# EAGLE design Stoitsov_Bostandzhieva (EAGLE 7.4.0)
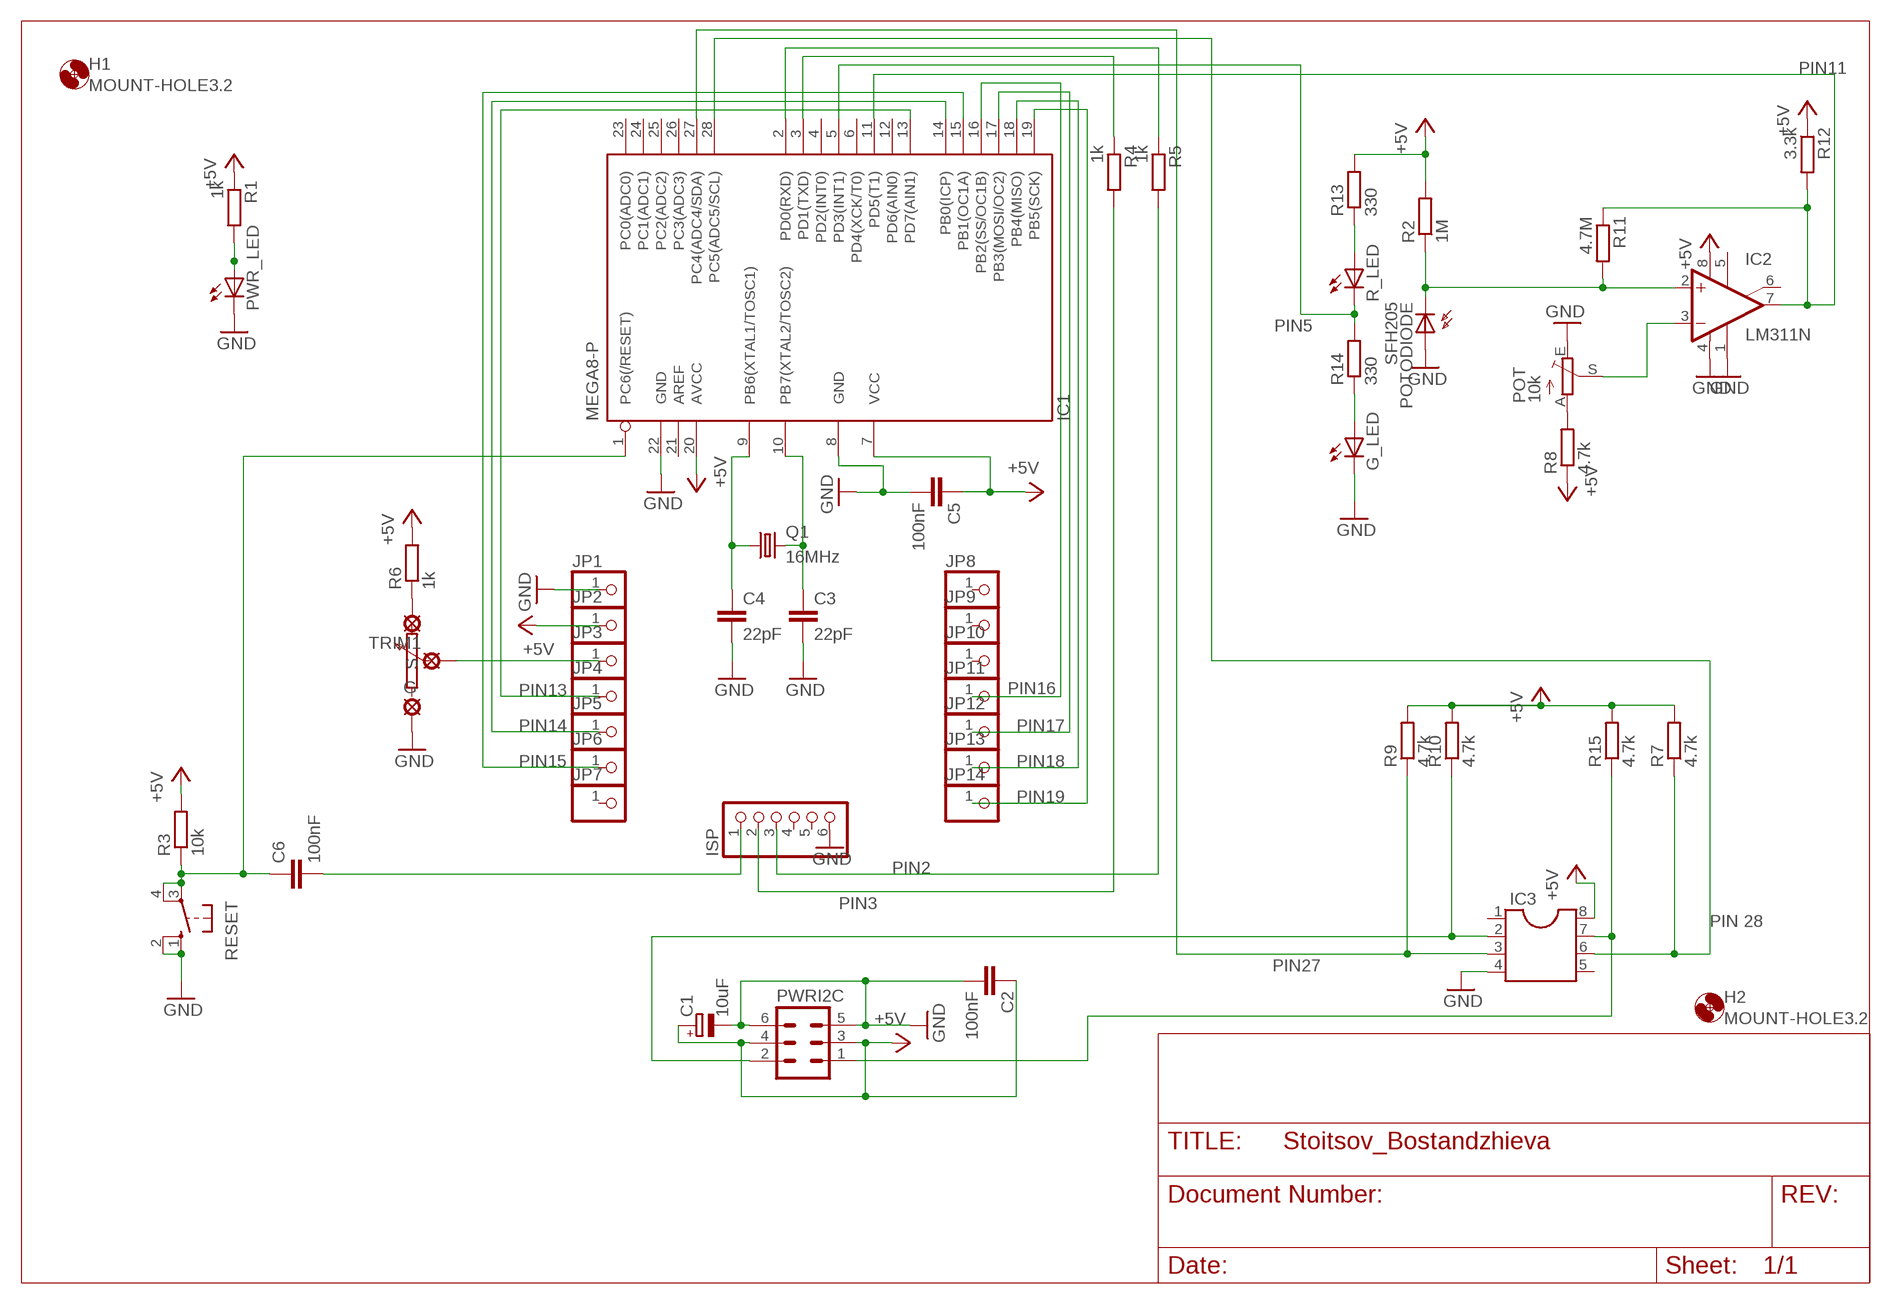
[diagram p0: schematic, sheet 1]

## Parts
C1  10uF  CPOL-EUE5-6  [E5-6]
C2  100nF  C5/2.5  [C5B2.5]
C3  22pF  C5/2.5  [C5B2.5]
C4  22pF  C5/2.5  [C5B2.5]
C5  100nF  C5/2.5  [C5B2.5]
C6  100nF  C5/2.5  [C5B2.5]
G  LSP11  [LSP11]
G_LED  LED3MM  [LED3MM]
H1  MOUNT-HOLE3.2  [3,2]
H2  MOUNT-HOLE3.2  [3,2]
IC1  MEGA8-P  [DIL28-3]
IC2  LM311N  [DIL08]
IC3  DIL8S  [SOCKET-08]
ISP  PINHD-1X6/90  [1X06/90]
JP1  PINHD-1X1  [1X01]
JP2  PINHD-1X1  [1X01]
JP3  PINHD-1X1  [1X01]
JP4  PINHD-1X1  [1X01]
JP5  PINHD-1X1  [1X01]
JP6  PINHD-1X1  [1X01]
JP7  PINHD-1X1  [1X01]
JP8  PINHD-1X1  [1X01]
JP9  PINHD-1X1  [1X01]
JP10  PINHD-1X1  [1X01]
JP11  PINHD-1X1  [1X01]
JP12  PINHD-1X1  [1X01]
JP13  PINHD-1X1  [1X01]
JP14  PINHD-1X1  [1X01]
POT  10k  TRIM_EU-S64W  [S64W]
POTODIODE  SFH205  [SFH205]
PWR_LED  LED3MM  [LED3MM]
PWRI2C  MA03-2  [MA03-2]
Q1  16MHz  CRYSTALHC18U-V  [HC18U-V]
R1  1k  R-EU_0207/12  [0207/12]
R2  1M  R-EU_0207/12  [0207/12]
R3  10k  R-EU_0207/12  [0207/12]
R4  1k  R-EU_0207/12  [0207/12]
R5  1k  R-EU_0207/12  [0207/12]
R6  1k  R-EU_0207/12  [0207/12]
R7  4.7k  R-EU_0207/12  [0207/12]
R8  4.7k  R-EU_0207/12  [0207/12]
R9  4.7k  R-EU_0207/12  [0207/12]
R10  4.7k  R-EU_0207/12  [0207/12]
R11  4.7M  R-EU_0207/12  [0207/12]
R12  3.3k  R-EU_0207/12  [0207/12]
R13  330  R-EU_0207/12  [0207/12]
R14  330  R-EU_0207/12  [0207/12]
R15  4.7k  R-EU_0207/12  [0207/12]
R_LED  LED3MM  [LED3MM]
RESET  10-XX  [B3F-10XX]
S  LSP11  [LSP11]
TRIM1  LSP11  [LSP11]

## Nets
+5V: C1.+ C2.1 C5.1 IC1.7(VCC) IC1.20(AVCC) IC2.8(V+) IC3.8 JP2.1 PWRI2C.3 PWRI2C.4 R1.1 R2.2 R3.2 R6.2 R7.2 R8.1 R9.2 R10.2 R12.1 R13.2 R15.2
GND: C1.- C2.2 C3.2 C4.2 C5.2 G.MP G_LED.K(C) IC1.8(GND) IC1.22(GND) IC2.1(GND) IC2.4(V-) IC3.4 ISP.6 JP1.1 POT.E POTODIODE.A PWR_LED.K(C) PWRI2C.5 PWRI2C.6 RESET.1(S) RESET.2(S1)
N$1: IC2.2(+IN) POTODIODE.K(C) R2.1 R11.2
N$2: IC1.11(PD5(T1)) IC2.7(OUT) R11.1 R12.2
N$3: POT.A R8.2
N$4: PWR_LED.A R1.2
N$5: C6.1 IC1.1(PC6(/RESET)) R3.1 RESET.3(P) RESET.4(P1)
N$6: C4.1 IC1.9(PB6(XTAL1/TOSC1)) Q1.1
N$7: C3.1 IC1.10(PB7(XTAL2/TOSC2)) Q1.2
N$8: C6.2 ISP.1
N$9: JP3.1 S.MP
N$10: IC1.3(PD1(TXD)) R4.1
N$11: IC1.2(PD0(RXD)) R5.1
N$12: ISP.2 R4.2
N$13: ISP.3 R5.2
N$14: R6.1 TRIM1.MP
N$15: IC1.27(PC4(ADC4/SDA)) IC3.3 R9.1
N$16: IC1.28(PC5(ADC5/SCL)) IC3.6 R7.1
N$18: IC3.7 PWRI2C.1 R15.1
N$19: IC1.19(PB5(SCK)) JP14.1
N$20: IC1.18(PB4(MISO)) JP13.1
N$21: IC1.17(PB3(MOSI/OC2)) JP12.1
N$22: IC1.16(PB2(SS/OC1B)) JP11.1
N$23: IC1.5(PD3(INT1)) R14.2 R_LED.K(C)
N$24: R13.1 R_LED.A
N$25: G_LED.A R14.1
N$26: IC2.3(-IN) POT.S
N$27: IC1.13(PD7(AIN1)) JP4.1
N$28: IC1.15(PB1(OC1A)) JP6.1
N$29: IC1.14(PB0(ICP)) JP5.1
N$30: IC3.2 PWRI2C.2 R10.1
Unconnected: IC1.4(PD2(INT0)) IC1.6(PD4(XCK/T0)) IC1.12(PD6(AIN0)) IC1.21(AREF) IC1.23(PC0(ADC0)) IC1.24(PC1(ADC1)) IC1.25(PC2(ADC2)) IC1.26(PC3(ADC3)) IC2.5(ON) IC2.6(ON/STR) IC3.1 IC3.5 ISP.4 ISP.5 JP7.1 JP8.1 JP9.1 JP10.1

## Notes on the sheet
- PIN11
- PIN5
- PIN13 | PIN16
- PIN14 | PIN17
- PIN15 | PIN18
- PIN19
- PIN2
- PIN3
- PIN 28
- PIN27

## Library data of the parts
C1 = resistor:CPOL-EU: POLARIZED CAPACITOR, European symbol
C2-C6 = capacitor-wima:C: CAPACITOR naming: grid - package width
G S TRIM1 = solpad:LSP11: SOLDER PAD drill 1.1 mm
G_LED PWR_LED R_LED = led:LED: LED OSRAM: - CHIPLED LG R971, LG N971, LY N971, LG Q971, LY Q971, LO R971, LY R971 LH N974, LH R974 LS Q976, LO Q976, LY Q976 LO Q996 - Hyper CHIPLED LW Q18S LB Q993, LB Q99A, LB R99A - SideLED LS A670, LO A670, LY A670, LG A670, LP A670 LB A673, LV A673, LT A673, LW A673 LH A674 LY A675 LS A676, LA A676, LO A676, LY A676, LW A676 LS A679, LY A679, LG A679 - Hyper Micro SIDELED® LS Y876, LA Y876, LO Y876, LY Y876 LT Y87S - SmartLED LW L88C, LW L88S LB L89C, LB L89S, LG L890 LS L89K, LO L89K, LY L89K LS L896, LA L896, LO L896, LY L896 - TOPLED LS T670, LO T670, LY T670, LG T670, LP T670 LSG T670, LSP T670, LSY T670, LOP T670, LYG T670 LG T671, LOG T671, LSG T671 LB T673, LV T673, LT T673, LW T673 LH T674 LS T676, LA T676, LO T676, LY T676, LB T676, LH T676, LSB T676, LW T676 LB T67C, LV T67C, LT T67C, LS T67K, LO T67K, LY T67K, LW E67C LS E67B, LA E67B, LO E67B, LY E67B, LB E67C, LV E67C, LT E67C LW T67C LS T679, LY T679, LG T679 LS T770, LO T770, LY T770, LG T770, LP T770 LB T773, LV T773, LT T773, LW T773 LH T774 LS E675, LA E675, LY E675, LS T675 LS T776, LA T776, LO T776, LY T776, LB T776 LHGB T686 LT T68C, LB T68C - Hyper Mini TOPLED® LB M676 - Mini TOPLED Santana® LG M470 LS M47K, LO M47K, LY M47K Source: http://www.osram.convergy.de LUXEON: - LUMILED® LXK2-PW12-R00, LXK2-PW12-S00, LXK2-PW14-U00, LXK2-PW14-V00 LXK2-PM12-R00, LXK2-PM12-S00, LXK2-PM14-U00 LXK2-PE12-Q00, LXK2-PE12-R00, LXK2-PE12-S00, LXK2-PE14-T00, LXK2-PE14-U00 LXK2-PB12-K00, LXK2-PB12-L00, LXK2-PB12-M00, LXK2-PB14-N00, LXK2-PB14-P00, LXK2-PB14-Q00 LXK2-PR12-L00, LXK2-PR12-M00, LXK2-PR14-Q00, LXK2-PR14-R00 LXK2-PD12-Q00, LXK2-PD12-R00, LXK2-PD12-S00 LXK2-PH12-R00, LXK2-PH12-S00 LXK2-PL12-P00, LXK2-PL12-Q00, LXK2-PL12-R00 Source: www.luxeon.com KINGBRIGHT: KA-3528ASYC Source: www.kingbright.com
H1 H2 = holes:MOUNT-HOLE: MOUNTING HOLE with drill center marker
IC1 = atmel:MEGA8-P: MICROCONTROLLER 8 Kbytes FLASH, 1 kbytes SRAM, 512 bytes EEPROM, USART, 4-channel 10 bit ADC, 2-channel 8 bit ADC Pin compatible with Atmega48, ATMega88, ATMega168 Source: avr.lbr; OC_FARNELL: unknown; OC_NEWARK: unknown
IC2 = linear:LM311: COMPARATOR
IC3 = ic-package:DIL8: Dual In Line / Socket
ISP = pinhead:PINHD-1X6: PIN HEADER
JP1-JP14 = pinhead:PINHD-1X1: PIN HEADER
POT = pot:TRIM_EU-: POTENTIOMETER
POTODIODE = opto-trans-siemens:SFH205: PHOTO DIODE; OC_FARNELL: unknown; OC_NEWARK: unknown
PWRI2C = con-lstb:MA03-2: PIN HEADER; OC_FARNELL: unknown; OC_NEWARK: unknown
Q1 = crystal:CRYSTAL: CRYSTAL; OC_FARNELL: unknown; OC_NEWARK: unknown
R1-R15 = resistor:R-EU_: RESISTOR, European symbol
RESET = switch-omron:10-XX: OMRON SWITCH; MPN: B3F-1000; OC_FARNELL: 176432; OC_NEWARK: 36M3542

## Board
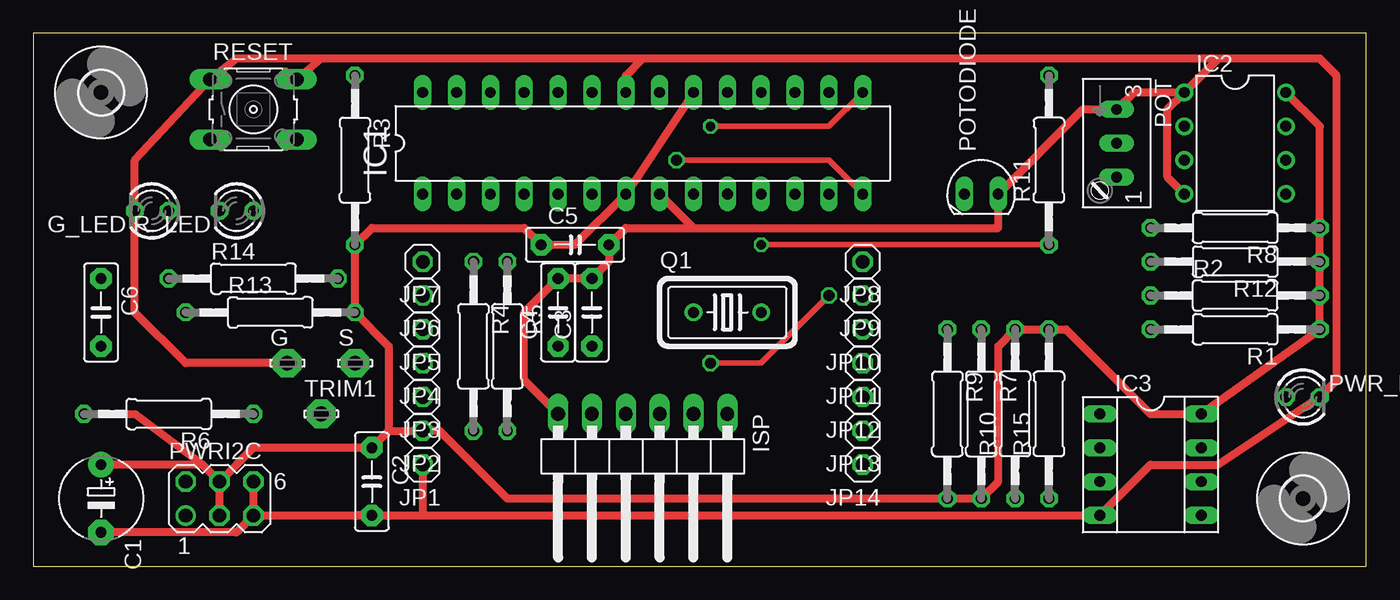
[diagram p1: board, top side]
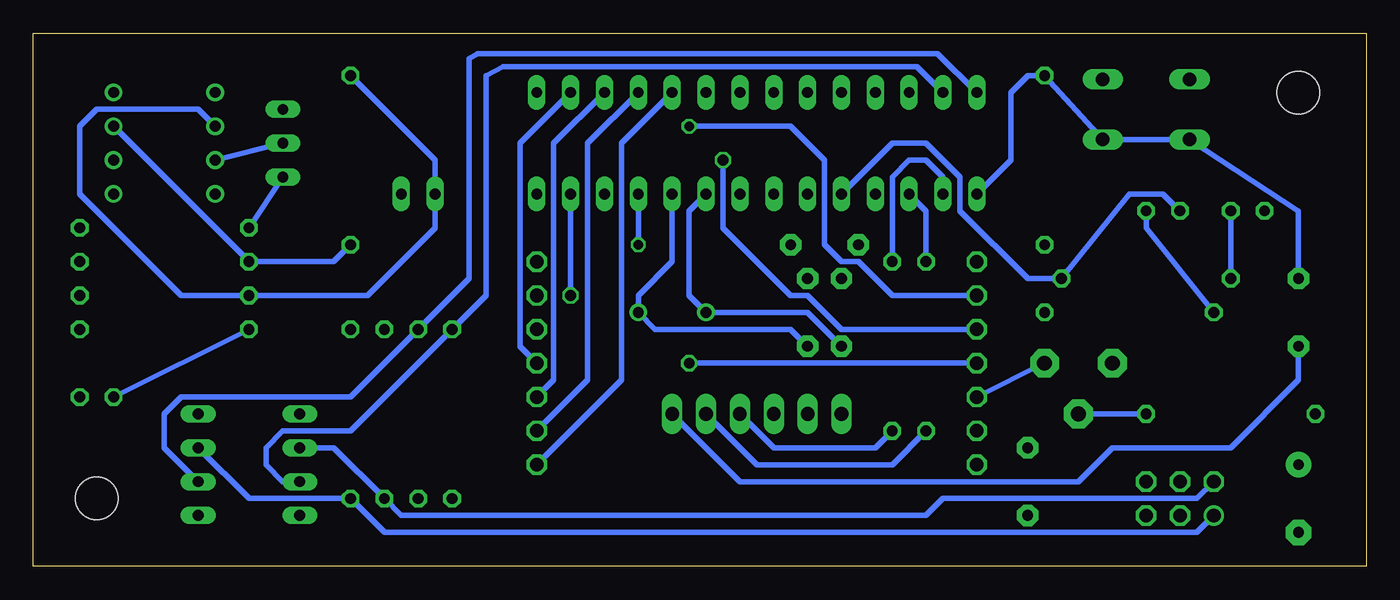
[diagram p2: board, bottom side, seen from below]

Size 100 x 40 mm. Coordinates in mm from the lower left corner, seen from the top.
Outline: 0,0 100,0 100,40 0,40 0,0
Copper layers (1*16): Top 0.035mm / dielectric 1.5mm / Bottom 0.035mm
Design rules "default": minimum track width 10mil, minimum drill 24mil, track to track 8mil, track to pad 8mil, pad to pad 8mil, via to via 8mil, smd to smd 8mil, copper to edge 40mil, drill to drill 8mil, minimum pad ring 10mil, minimum via ring 8mil, stop-mask expansion 4mil, vias tented up to drill 0mil, thermal gap 10mil

### Footprints (pad centres in the part's own frame; a part is rotated, then mirrored left to right if it is on the bottom)
E5-6 = drill 0.813 pad 1.905: + -2.54,0 | drill 0.813 pad 1.905 octagon: - 2.54,0
C5B2.5 = drill 0.813 pad 1.6 octagon: 1 -2.54,0; 2 2.54,0
LSP11 = drill 1.118 pad 2.159 octagon: MP 0,0
LED3MM = drill 0.813 octagon: A -1.27,0; K 1.27,0
3,2 = hole 3.2: 0,0
DIL28-3 = drill 0.813 long: 1 -16.51,-3.81; 2 -13.97,-3.81; 3 -11.43,-3.81; 4 -8.89,-3.81; 5 -6.35,-3.81; 6 -3.81,-3.81; 7 -1.27,-3.81; 8 1.27,-3.81; 9 3.81,-3.81; 10 6.35,-3.81; 11 8.89,-3.81; 12 11.43,-3.81; 13 13.97,-3.81; 14 16.51,-3.81; 15 16.51,3.81; 16 13.97,3.81; 17 11.43,3.81; 18 8.89,3.81; 19 6.35,3.81; 20 3.81,3.81; 21 1.27,3.81; 22 -1.27,3.81; 23 -3.81,3.81; 24 -6.35,3.81; 25 -8.89,3.81; 26 -11.43,3.81; 27 -13.97,3.81; 28 -16.51,3.81
DIL08 = drill 0.813 pad 1.27: 1 -3.81,-3.81; 2 -1.27,-3.81; 3 1.27,-3.81; 4 3.81,-3.81; 5 3.81,3.81; 6 1.27,3.81; 7 -1.27,3.81; 8 -3.81,3.81
SOCKET-08 = drill 0.813 long: 1 -3.81,-3.81; 2 -1.27,-3.81; 3 1.27,-3.81; 4 3.81,-3.81; 5 3.81,3.81; 6 1.27,3.81; 7 -1.27,3.81; 8 -3.81,3.81
1X06/90 = drill 1.016 long: 1 -6.35,-3.81; 2 -3.81,-3.81; 3 -1.27,-3.81; 4 1.27,-3.81; 5 3.81,-3.81; 6 6.35,-3.81
1X01 = drill 1.016 octagon: 1 0,0
S64W = drill 0.813 long: A 2.54,1.27; E -2.54,1.27; S 0,1.27
SFH205 = drill 0.813 long: A 0,-1.27; K 0,1.27
MA03-2 = drill 1.016: 1 -2.54,-1.27 | drill 1.016 octagon: 2 -2.54,1.27; 3 0,-1.27; 4 0,1.27; 5 2.54,-1.27; 6 2.54,1.27
HC18U-V = drill 0.813: 1 -2.54,0; 2 2.54,0
0207/12 = drill 0.813 octagon: 1 -6.35,0; 2 6.35,0
B3F-10XX = drill 1.016 long: 1 -3.251,2.261; 2 3.251,2.261; 3 -3.251,-2.261; 4 3.251,-2.261

### Placement (x,y rotation side)
C1  5.08,5.08 270 top
C2  25.4,6.35 270 top
C3  41.91,19.05 90 top
C4  39.37,19.05 90 top
C5  40.64,24.13 0 top
C6  5.08,19.05 270 top
G  19.05,15.24 0 top
G_LED  8.89,26.67 180 top
H1  95.25,5.08 0 top
H2  5.08,35.56 0 top
IC1  45.72,31.75 0 top
IC2  90.17,31.75 270 top
IC3  83.82,7.62 270 top
ISP  45.72,7.62 180 top
JP1  29.21,7.62 180 top
JP2  29.21,10.16 180 top
JP3  29.21,12.7 180 top
JP4  29.21,15.24 180 top
JP5  29.21,17.78 180 top
JP6  29.21,20.32 180 top
JP7  29.21,22.86 180 top
JP8  62.23,22.86 180 top
JP9  62.23,20.32 180 top
JP10  62.23,17.78 180 top
JP11  62.23,15.24 180 top
JP12  62.23,12.7 180 top
JP13  62.23,10.16 180 top
JP14  62.23,7.62 180 top
POT  80.01,31.75 270 top
POTODIODE  71.12,27.94 90 top
PWR_LED  95.25,12.7 0 top
PWRI2C  13.97,5.08 0 top
Q1  52.07,19.05 0 top
R1  90.17,17.78 180 top
R2  90.17,20.32 0 top
R3  24.13,30.48 270 top
R4  33.02,16.51 270 top
R5  35.56,16.51 270 top
R6  10.16,11.43 180 top
R7  71.12,11.43 270 top
R8  90.17,25.4 180 top
R9  68.58,11.43 270 top
R10  73.66,11.43 90 top
R11  76.2,30.48 90 top
R12  90.17,22.86 180 top
R13  17.78,19.05 0 top
R14  16.51,21.59 0 top
R15  76.2,11.43 90 top
R_LED  15.24,26.67 180 top
RESET  16.51,34.29 0 top
S  24.13,15.24 0 top
TRIM1  21.59,11.43 0 top

### Tracks (layer width: path | path; a pad name or v marks a point on that pad's centre or on a via)
+5V
  Top 0.61: PWRI2C.3 PWRI2C.4 | PWRI2C.4 12.7,7.62 | 12.7,7.62 C1.+ | R6.2 7.62,11.43 12.7,7.62 | PWRI2C.4 16.51,8.89 C2.1 26.67,10.16 | IC2.8 96.52,33.02 R8.1 R12.1 R2.2 R1.1 IC3.8 83.82,11.43 77.47,17.78 R15.2 R10.2 72.39,16.51 72.39,6.35 R7.2 R9.2 35.56,5.08 30.48,10.16 JP2.1 26.67,10.16 | IC1.20 IC1.7 40.64,24.13 C5.1 36.83,25.4 25.4,25.4 R3.2 R13.2 26.67,16.51 26.67,10.16
GND
  Top 0.61: PWRI2C.6 PWRI2C.5 | 88.9,38.1 96.52,38.1 97.79,36.83 97.79,13.97 PWR_LED.K 88.9,7.62 83.82,7.62 IC3.4 29.21,3.81 | 88.9,38.1 45.72,38.1 | 45.72,38.1 21.59,38.1 | 21.59,38.1 15.24,38.1 RESET.1 7.62,30.48 G_LED.K 7.62,19.05 11.43,15.24 G.MP | IC1.22 44.45,36.83 45.72,38.1 | PWRI2C.5 15.24,2.54 C1.- | IC2.1 88.9,38.1 | IC2.1 82.55,35.56 POT.E 78.74,34.29 POTODIODE.A 72.39,25.4 49.53,25.4 | C2.2 24.13,3.81 | PWRI2C.5 C2.2 | C2.2 29.21,3.81 | ISP.6 36.83,13.97 36.83,19.05 C4.2 C3.2 43.18,22.86 C5.2 44.45,25.4 49.53,25.4 | IC2.4 85.09,29.21 85.09,34.29 IC2.1 | RESET.2 21.59,38.1 | 49.53,25.4 IC1.8 | JP1.1 29.21,3.81
N$1
  Bottom 0.406: IC2.2 87.63,34.29 95.25,34.29 96.52,33.02 96.52,27.94 88.9,20.32 R2.1 74.93,20.32 69.85,25.4 POTODIODE.K 69.85,30.48 R11.2
N$2  (via drill 0.7)
  Top 0.406: R11.1 v54.61,24.13
  Bottom 0.406: R11.1 77.47,22.86 R12.2 IC2.7 | v54.61,24.13 IC1.11
N$3
  Bottom 0.406: R8.2 POT.A
N$4
  Bottom 0.406: R1.2 PWR_LED.A
N$5
  Bottom 0.406: C6.1 5.08,26.67 RESET.3 RESET.4 R3.1 25.4,36.83 26.67,35.56 26.67,30.48 IC1.1
N$6
  Bottom 0.406: C4.1 41.91,19.05 Q1.1 50.8,20.32 50.8,26.67 IC1.9
N$7
  Bottom 0.406: IC1.10 52.07,22.86 54.61,20.32 Q1.2 53.34,17.78 43.18,17.78 C3.1
N$8
  Bottom 0.406: ISP.1 46.99,6.35 21.59,6.35 19.05,8.89 10.16,8.89 5.08,13.97 C6.2
N$9
  Bottom 0.406: S.MP JP3.1
N$10
  Bottom 0.406: IC1.3 33.02,26.67 R4.1
N$11
  Bottom 0.406: R5.1 35.56,29.21 34.29,30.48 33.02,30.48 31.75,29.21 IC1.2
N$12
  Bottom 0.406: ISP.2 45.72,7.62 35.56,7.62 R4.2
N$13
  Bottom 0.406: ISP.3 44.45,8.89 36.83,8.89 R5.2
N$14
  Bottom 0.406: R6.1 TRIM1.MP
N$15
  Bottom 0.406: IC1.27 33.69,37.5 64.77,37.5 66.04,36.83 66.04,20.32 R9.1 76.2,10.16 81.28,10.16 82.55,8.89 82.55,7.62 81.28,6.35 IC3.3
N$16
  Bottom 0.406: IC3.6 90.17,8.89 90.17,11.43 88.9,12.7 76.2,12.7 R7.1 67.31,21.59 67.31,38.1 66.67,38.47 32.16,38.47 IC1.28
N$18
  Bottom 0.406: IC3.7 83.82,5.08 R15.1 73.66,2.54 12.7,2.54 PWRI2C.1
N$19
  Bottom 0.406: JP14.1 55.88,13.97 55.88,31.75 IC1.19
N$20
  Bottom 0.406: JP13.1 58.42,13.97 58.42,31.75 IC1.18
N$21
  Bottom 0.406: JP12.1 60.96,13.97 60.96,31.75 IC1.17
N$22
  Bottom 0.406: JP11.1 63.5,16.51 63.5,31.75 IC1.16
N$23
  Bottom 0.406: R_LED.K 15.24,27.94 17.78,27.94 R14.2 25.4,21.59 30.48,26.67 30.48,29.21 33.02,31.75 35.56,31.75 IC1.5
N$24
  Bottom 0.406: R_LED.A 16.51,25.4 R13.1
N$25
  Bottom 0.406: G_LED.A R14.1
N$26
  Bottom 0.406: POT.S IC2.3
N$27  (via drill 0.8)
  Top 0.406: v50.8,15.24 54.61,15.24 v59.69,20.32
  Bottom 0.406: JP4.1 v50.8,15.24 | v59.69,20.32 IC1.13
N$28  (via drill 0.7)
  Top 0.406: v50.8,33.02 59.69,33.02 IC1.15
  Bottom 0.406: JP6.1 35.56,20.32 38.1,22.86 39.37,22.86 40.64,24.13 40.64,30.48 43.18,33.02 v50.8,33.02
N$29  (via drill 0.8)
  Top 0.406: v48.26,30.48 59.69,30.48 IC1.14
  Bottom 0.406: JP5.1 39.37,17.78 41.91,20.32 43.18,20.32 48.26,25.4 v48.26,30.48
N$30
  Bottom 0.406: IC3.2 77.47,8.89 R10.1 72.39,3.81 33.02,3.81 31.75,5.08 12.7,5.08 PWRI2C.2

### Text on the board
Document: 1 | 8 | + | GREEN | RED | + | + | 1 | G | S | + | 1 | 8 | + | 1 | 14